# EAGLE design untitled (EAGLE 5.08)
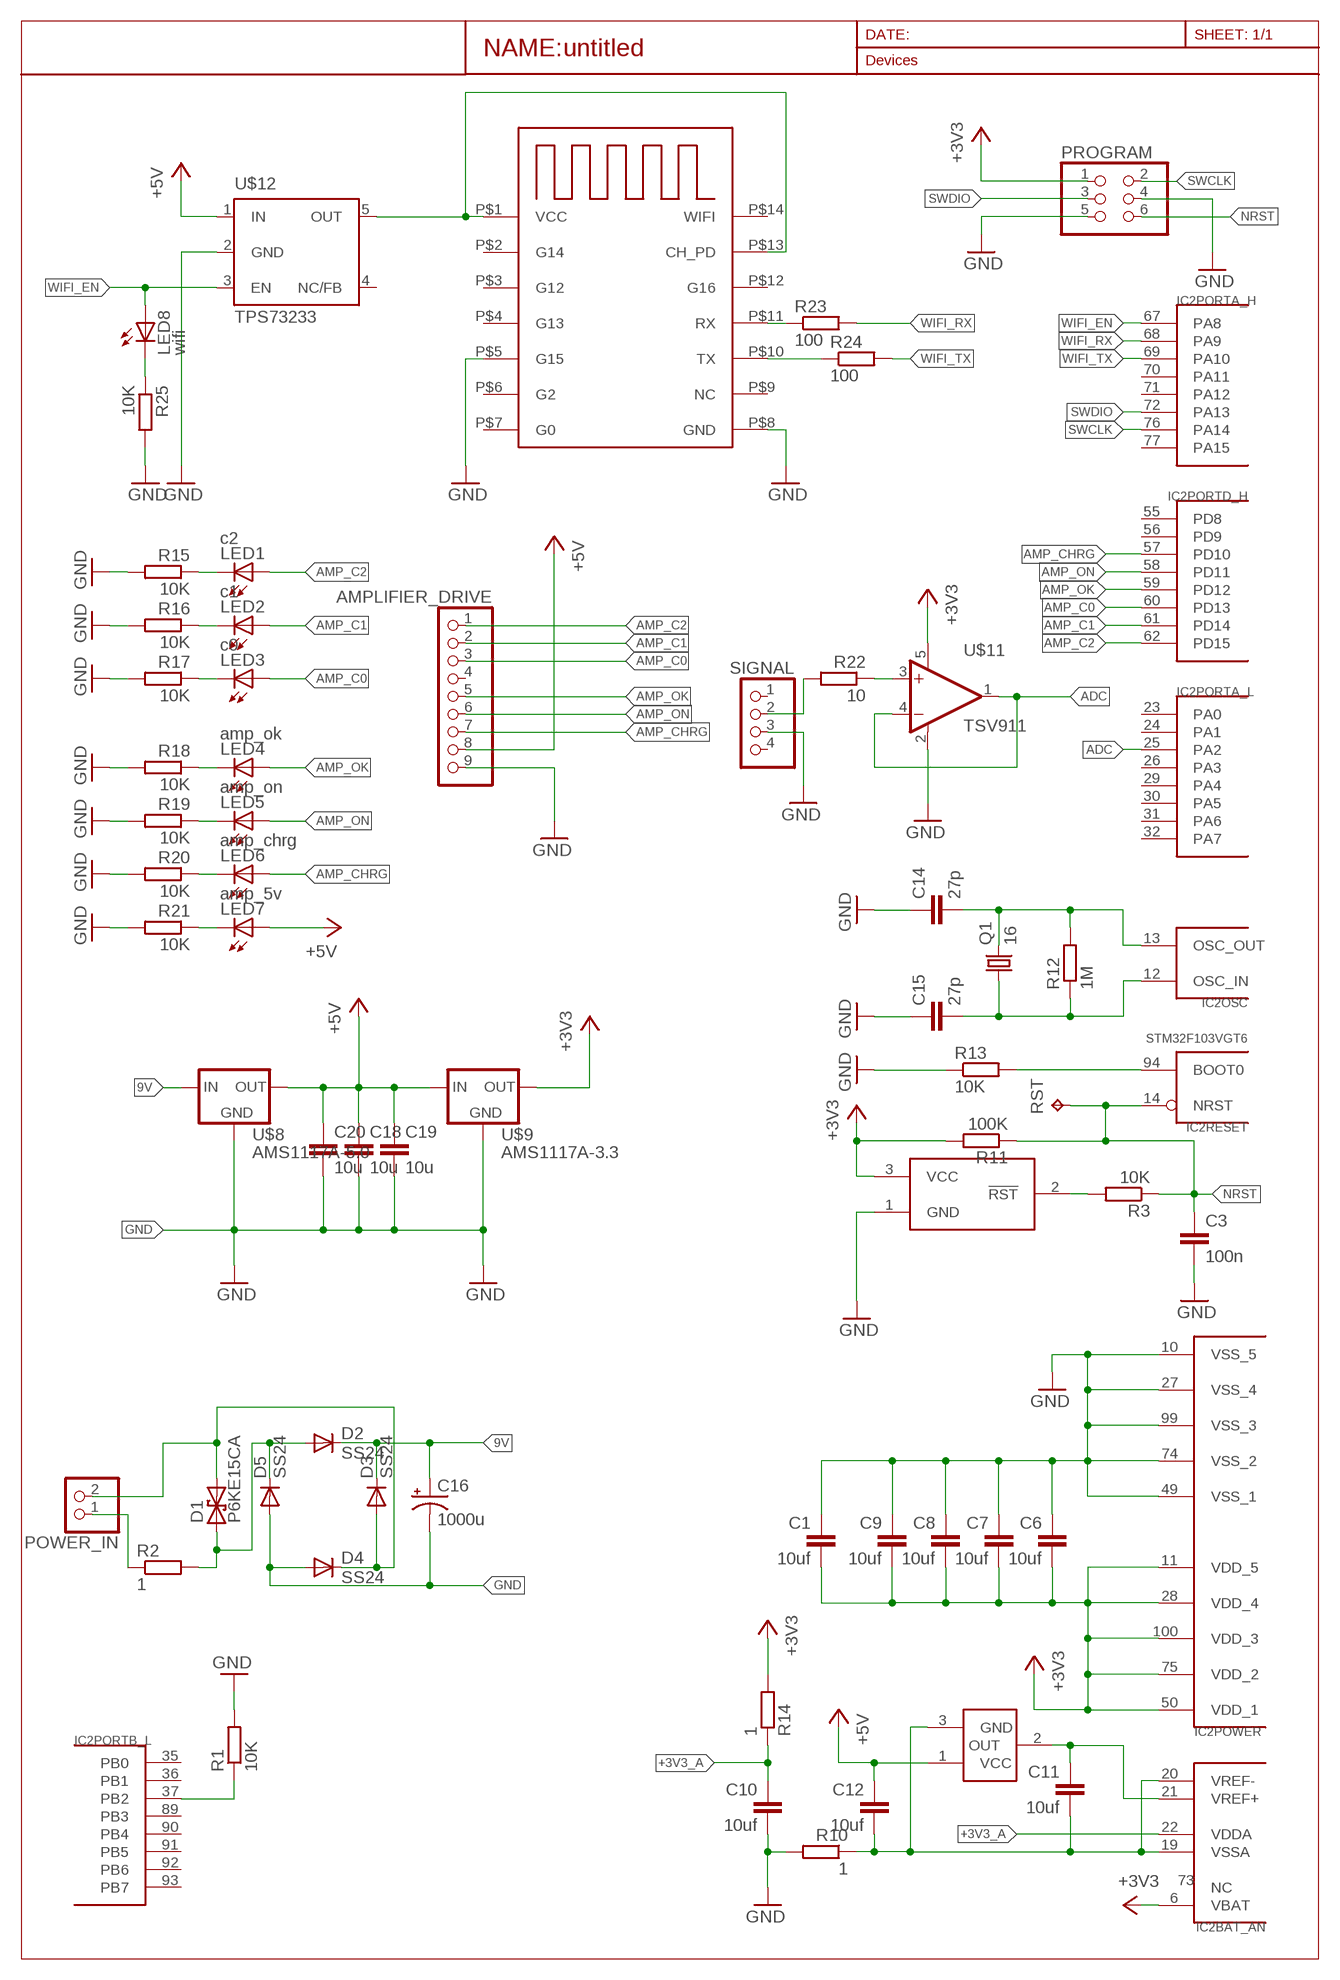
[diagram p0: schematic, sheet 1]

## Parts
AMPLIFIER_DRIVE  PINHD-1X09_2.54-S  [1X09-S]
C1  10uf  C-EUC0603  [C0603]
C3  100n  C-EUC0805  [C0805]
C6  10uf  C-EUC0603  [C0603]
C7  10uf  C-EUC0603  [C0603]
C8  10uf  C-EUC0603  [C0603]
C9  10uf  C-EUC0603  [C0603]
C10  10uf  C-EUC0603  [C0603]
C11  10uf  C-EUC0603  [C0603]
C12  10uf  C-EUC0805  [C0805]
C14  27p  C-EUC0603  [C0603]
C15  27p  C-EUC0603  [C0603]
C16  1000u  CPOL-USE5-8.5  [E5-8,5]
C18  10u  C-EUC0603  [C0603]
C19  10u  C-EUC0805  [C0805]
C20  10u  C-EUC0805  [C0805]
D1  P6KE15CA  P6KEXXC  [CB417-15]
D2  SS24  DIODE-SMB  [SMB]
D3  SS24  DIODE-SMB  [SMB]
D4  SS24  DIODE-SMB  [SMB]
D5  SS24  DIODE-SMB  [SMB]
IC2  STM32F103VGT6  STM32F10XVXT6  [TQFP100]
LED1  c2  LEDCHIPLED_0805  [CHIPLED_0805]
LED2  c1  LEDCHIPLED_0805  [CHIPLED_0805]
LED3  c0  LEDCHIPLED_0805  [CHIPLED_0805]
LED4  amp_ok  LEDCHIPLED_0805  [CHIPLED_0805]
LED5  amp_on  LEDCHIPLED_0805  [CHIPLED_0805]
LED6  amp_chrg  LEDCHIPLED_0805  [CHIPLED_0805]
LED7  amp_5v  LEDCHIPLED_0805  [CHIPLED_0805]
LED8  wifi  LEDCHIPLED_0805  [CHIPLED_0805]
POWER_IN  PINHD-1X2  [1X02]
PROGRAM  PINHD-2X03_2.54-SMD  [2X03SMD]
Q1  16  CRYSTALHC49UP  [HC49UP]
R1  10K  R-EU_R0603  [R0603]
R2  1  R-EU_R1206  [R1206]
R3  10K  R-EU_R0603  [R0603]
R10  1  R-EU_R0603  [R0603]
R11  100K  R-EU_R0603  [R0603]
R12  1M  R-EU_R0603  [R0603]
R13  10K  R-EU_R0603  [R0603]
R14  1  R-EU_R0603  [R0603]
R15  10K  R-EU_R0603  [R0603]
R16  10K  R-EU_R0603  [R0603]
R17  10K  R-EU_R0603  [R0603]
R18  10K  R-EU_R0603  [R0603]
R19  10K  R-EU_R0603  [R0603]
R20  10K  R-EU_R0603  [R0603]
R21  10K  R-EU_R0603  [R0603]
R22  10  R-EU_R0603  [R0603]
R23  100  R-EU_R0603  [R0603]
R24  100  R-EU_R0603  [R0603]
R25  10K  R-EU_R0603  [R0603]
RST  TPTP14SQ  [TP14SQ]
SIGNAL  PINHD-1X04_2.54-S  [1X04-S]
U$6  REF3025  [SOT23]
U$7  ESP03  [ESP03]
U$8  AMS1117A-5.0  AMS1117A  [DPACK]
U$9  AMS1117A-3.3  AMS1117A  [DPACK]
U$10  LM809  [SOT23]
U$11  TSV911  [SOT23-5L]
U$12  TPS73233  [SOT23-DBV]

## Nets
9V: C16.+ D2.C D3.C U$8.3(IN)
+3V3: C1.2 C6.2 C7.2 C8.2 C9.2 IC2.6(BAT_AN:VBAT) IC2.11(POWER:VDD_5) IC2.28(POWER:VDD_4) IC2.50(POWER:VDD_1) IC2.75(POWER:VDD_2) IC2.100(POWER:VDD_3) PROGRAM.1 R11.2 R14.2 U$9.2(OUT) U$10.3(VCC) U$11.5(V+)
+3V3_A: C10.1 IC2.22(BAT_AN:VDDA) R14.1
+5V: AMPLIFIER_DRIVE.8 C12.1 C18.1 C19.1 C20.1 LED7.A U$6.1(VCC) U$8.2(OUT) U$9.3(IN) U$12.1(IN)
ADC: IC2.25(PORTA_L:PA2) U$11.1(OUT) U$11.4(-IN)
AMP_C0: AMPLIFIER_DRIVE.3 IC2.60(PORTD_H:PD13) LED3.A
AMP_C1: AMPLIFIER_DRIVE.2 IC2.61(PORTD_H:PD14) LED2.A
AMP_C2: AMPLIFIER_DRIVE.1 IC2.62(PORTD_H:PD15) LED1.A
AMP_CHRG: AMPLIFIER_DRIVE.7 IC2.57(PORTD_H:PD10) LED6.A
AMP_OK: AMPLIFIER_DRIVE.5 IC2.59(PORTD_H:PD12) LED4.A
AMP_ON: AMPLIFIER_DRIVE.6 IC2.58(PORTD_H:PD11) LED5.A
GND: AMPLIFIER_DRIVE.9 C1.1 C3.2 C6.1 C7.1 C8.1 C9.1 C10.2 C14.1 C15.1 C16.- C18.2 C19.2 C20.2 D4.A D5.A IC2.10(POWER:VSS_5) IC2.27(POWER:VSS_4) IC2.49(POWER:VSS_1) IC2.74(POWER:VSS_2) IC2.99(POWER:VSS_3) PROGRAM.4 PROGRAM.5 R1.2 R10.2 R13.1 R15.2 R16.2 R17.2 R18.2 R19.2 R20.2 R21.2 R25.2 SIGNAL.3 U$7.P$5(G15) U$7.P$8(GND) U$8.1(GND) U$9.1(GND) U$10.1(GND) U$11.2(V-) U$12.2(GND)
GND_A: C11.2 C12.2 IC2.19(BAT_AN:VSSA) IC2.20(BAT_AN:VREF-) R10.1 U$6.3(GND)
N$1: IC2.37(PORTB_L:PB2) R1.1
N$2: POWER_IN.1 R2.1
N$3: R3.2 U$10.2(!RST)
N$12: D1.A D2.A D5.C R2.2
N$14: C11.1 IC2.21(BAT_AN:VREF+) U$6.2(OUT)
N$20: C14.2 IC2.13(OSC:OSC_OUT) Q1.2 R12.2
N$21: C15.2 IC2.12(OSC:OSC_IN) Q1.1 R12.1
N$22: IC2.94(RESET:BOOT0) R13.2
N$23: D1.C D3.A D4.C POWER_IN.2
N$24: U$7.P$1(VCC) U$7.P$13(CH_PD) U$12.5(OUT)
N$25: LED8.C R25.1
N$28: R22.1 U$11.3(+IN)
N$29: LED7.C R21.1
N$32: R22.2 SIGNAL.2
N$35: LED1.C R15.1
N$36: LED2.C R16.1
N$37: LED3.C R17.1
N$38: LED4.C R18.1
N$39: LED5.C R19.1
N$40: LED6.C R20.1
NRST: C3.1 IC2.14(RESET:NRST) PROGRAM.6 R3.1 R11.1 RST.TP
SWCLK: IC2.76(PORTA_H:PA14) PROGRAM.2
SWDIO: IC2.72(PORTA_H:PA13) PROGRAM.3
WIFI_EN: IC2.67(PORTA_H:PA8) LED8.A U$12.3(EN)
WIFI_RX: IC2.68(PORTA_H:PA9) R23.2
WIFI_RX1: R23.1 U$7.P$11(RX)
WIFI_TX: IC2.69(PORTA_H:PA10) R24.2
WIFI_TX1: R24.1 U$7.P$10(TX)
Unconnected: AMPLIFIER_DRIVE.4 IC2.1(PORTE_L:PE2) IC2.2(PORTE_L:PE3) IC2.3(PORTE_L:PE4) IC2.4(PORTE_L:PE5) IC2.5(PORTE_L:PE6) IC2.7(PORTC_H:PC13) IC2.8(PORTC_H:PC14) IC2.9(PORTC_H:PC15) IC2.15(PORTC_L:PC0) IC2.16(PORTC_L:PC1) IC2.17(PORTC_L:PC2) IC2.18(PORTC_L:PC3) IC2.23(PORTA_L:PA0) IC2.24(PORTA_L:PA1) IC2.26(PORTA_L:PA3) IC2.29(PORTA_L:PA4) IC2.30(PORTA_L:PA5) IC2.31(PORTA_L:PA6) IC2.32(PORTA_L:PA7) IC2.33(PORTC_L:PC4) IC2.34(PORTC_L:PC5) IC2.35(PORTB_L:PB0) IC2.36(PORTB_L:PB1) IC2.38(PORTE_L:PE7) IC2.39(PORTE_H:PE8) IC2.40(PORTE_H:PE9) IC2.41(PORTE_H:PE10) IC2.42(PORTE_H:PE11) IC2.43(PORTE_H:PE12) IC2.44(PORTE_H:PE13) IC2.45(PORTE_H:PE14) IC2.46(PORTE_H:PE15) IC2.47(PORTB_H:PB10) IC2.48(PORTB_H:PB11) IC2.51(PORTB_H:PB12) IC2.52(PORTB_H:PB13) IC2.53(PORTB_H:PB14) IC2.54(PORTB_H:PB15) IC2.55(PORTD_H:PD8) IC2.56(PORTD_H:PD9) IC2.63(PORTC_L:PC6) IC2.64(PORTC_L:PC7) IC2.65(PORTC_H:PC8) IC2.66(PORTC_H:PC9) IC2.70(PORTA_H:PA11) IC2.71(PORTA_H:PA12) IC2.73(BAT_AN:NC) IC2.77(PORTA_H:PA15) IC2.78(PORTC_H:PC10) IC2.79(PORTC_H:PC11) IC2.80(PORTC_H:PC12) IC2.81(PORTD_L:PD0) IC2.82(PORTD_L:PD1) IC2.83(PORTD_L:PD2) IC2.84(PORTD_L:PD3) IC2.85(PORTD_L:PD4) IC2.86(PORTD_L:PD5) IC2.87(PORTD_L:PD6) IC2.88(PORTD_L:PD7) IC2.89(PORTB_L:PB3) IC2.90(PORTB_L:PB4) IC2.91(PORTB_L:PB5) IC2.92(PORTB_L:PB6) IC2.93(PORTB_L:PB7) IC2.95(PORTB_H:PB8) IC2.96(PORTB_H:PB9) IC2.97(PORTE_L:PE0) IC2.98(PORTE_L:PE1) SIGNAL.1 SIGNAL.4 U$7.P$2(G14) U$7.P$3(G12) U$7.P$4(G13) U$7.P$6(G2) U$7.P$7(G0) U$7.P$9(NC) U$7.P$12(G16) U$7.P$14(WIFI) U$12.4(NC/FB)

## Library data of the parts
AMPLIFIER_DRIVE = pinhead-2:PINHD-1X09: PIN HEADER
C1 C3 C6-C12 C14 C15 C18-C20 = rcl:C-EU: CAPACITOR, European symbol
C16 = rcl:CPOL-US: POLARIZED CAPACITOR, American symbol
D1 = diode:P6KEXXC: DIODE transient-voltage suppressor
D2-D5 = diode:DIODE-: DIODE
IC2 = stm32:STM32F10XVXT6: STM32F101/103 100 pin LQFP
LED1-LED8 = led:LED: LED OSRAM: - CHIPLED LG R971, LG N971, LY N971, LG Q971, LY Q971, LO R971, LY R971 LH N974, LH R974 LS Q976, LO Q976, LY Q976 LO Q996 - Hyper CHIPLED LW Q18S LB Q993, LB Q99A, LB R99A - SideLED LS A670, LO A670, LY A670, LG A670, LP A670 LB A673, LV A673, LT A673, LW A673 LH A674 LY A675 LS A676, LA A676, LO A676, LY A676, LW A676 LS A679, LY A679, LG A679 - Hyper Micro SIDELED® LS Y876, LA Y876, LO Y876, LY Y876 LT Y87S - SmartLED LW L88C, LW L88S LB L89C, LB L89S, LG L890 LS L89K, LO L89K, LY L89K LS L896, LA L896, LO L896, LY L896 - TOPLED LS T670, LO T670, LY T670, LG T670, LP T670 LSG T670, LSP T670, LSY T670, LOP T670, LYG T670 LG T671, LOG T671, LSG T671 LB T673, LV T673, LT T673, LW T673 LH T674 LS T676, LA T676, LO T676, LY T676, LB T676, LH T676, LSB T676, LW T676 LB T67C, LV T67C, LT T67C, LS T67K, LO T67K, LY T67K, LW E67C LS E67B, LA E67B, LO E67B, LY E67B, LB E67C, LV E67C, LT E67C LW T67C LS T679, LY T679, LG T679 LS T770, LO T770, LY T770, LG T770, LP T770 LB T773, LV T773, LT T773, LW T773 LH T774 LS E675, LA E675, LY E675, LS T675 LS T776, LA T776, LO T776, LY T776, LB T776 LHGB T686 LT T68C, LB T68C - Hyper Mini TOPLED® LB M676 - Mini TOPLED Santana® LG M470 LS M47K, LO M47K, LY M47K Source: http://www.osram.convergy.de LUXEON: - LUMILED® LXK2-PW12-R00, LXK2-PW12-S00, LXK2-PW14-U00, LXK2-PW14-V00 LXK2-PM12-R00, LXK2-PM12-S00, LXK2-PM14-U00 LXK2-PE12-Q00, LXK2-PE12-R00, LXK2-PE12-S00, LXK2-PE14-T00, LXK2-PE14-U00 LXK2-PB12-K00, LXK2-PB12-L00, LXK2-PB12-M00, LXK2-PB14-N00, LXK2-PB14-P00, LXK2-PB14-Q00 LXK2-PR12-L00, LXK2-PR12-M00, LXK2-PR14-Q00, LXK2-PR14-R00 LXK2-PD12-Q00, LXK2-PD12-R00, LXK2-PD12-S00 LXK2-PH12-R00, LXK2-PH12-S00 LXK2-PL12-P00, LXK2-PL12-Q00, LXK2-PL12-R00 Source: www.luxeon.com KINGBRIGHT: KA-3528ASYC Source: www.kingbright.com
POWER_IN = pinhead:PINHD-1X2: PIN HEADER
PROGRAM = pinhead-2:PINHD-2X03: PIN HEADER
Q1 = crystal:CRYSTAL: CRYSTAL
R1-R3 R10-R25 = resistor:R-EU_: RESISTOR, European symbol
RST = testpad:TP: Test pad
SIGNAL = pinhead-2:PINHD-1X04: PIN HEADER
U$6 = ADC:REF3025
U$7 = connectors:ESP03
U$8 U$9 = stabil:AMS1117A
U$10 = ARM:LM809
U$11 = OU:TSV911
U$12 = stabil:TPS73233

## Board
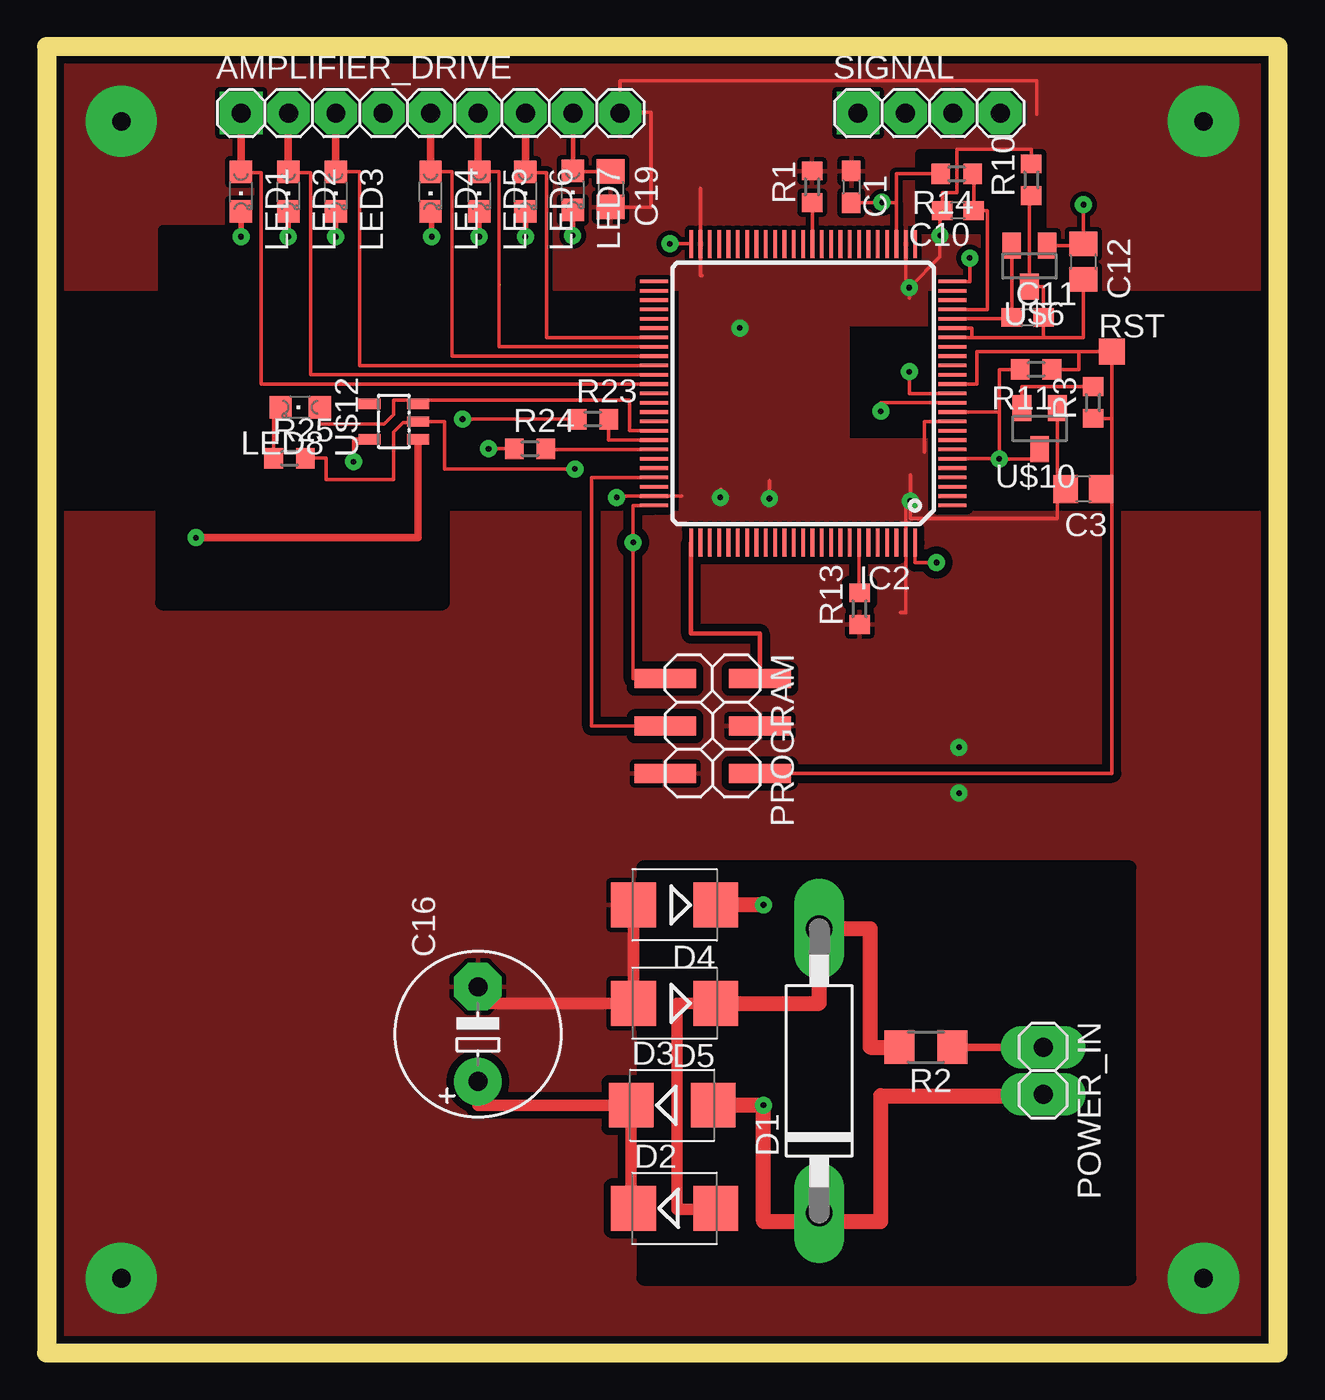
[diagram p1: board, top side]
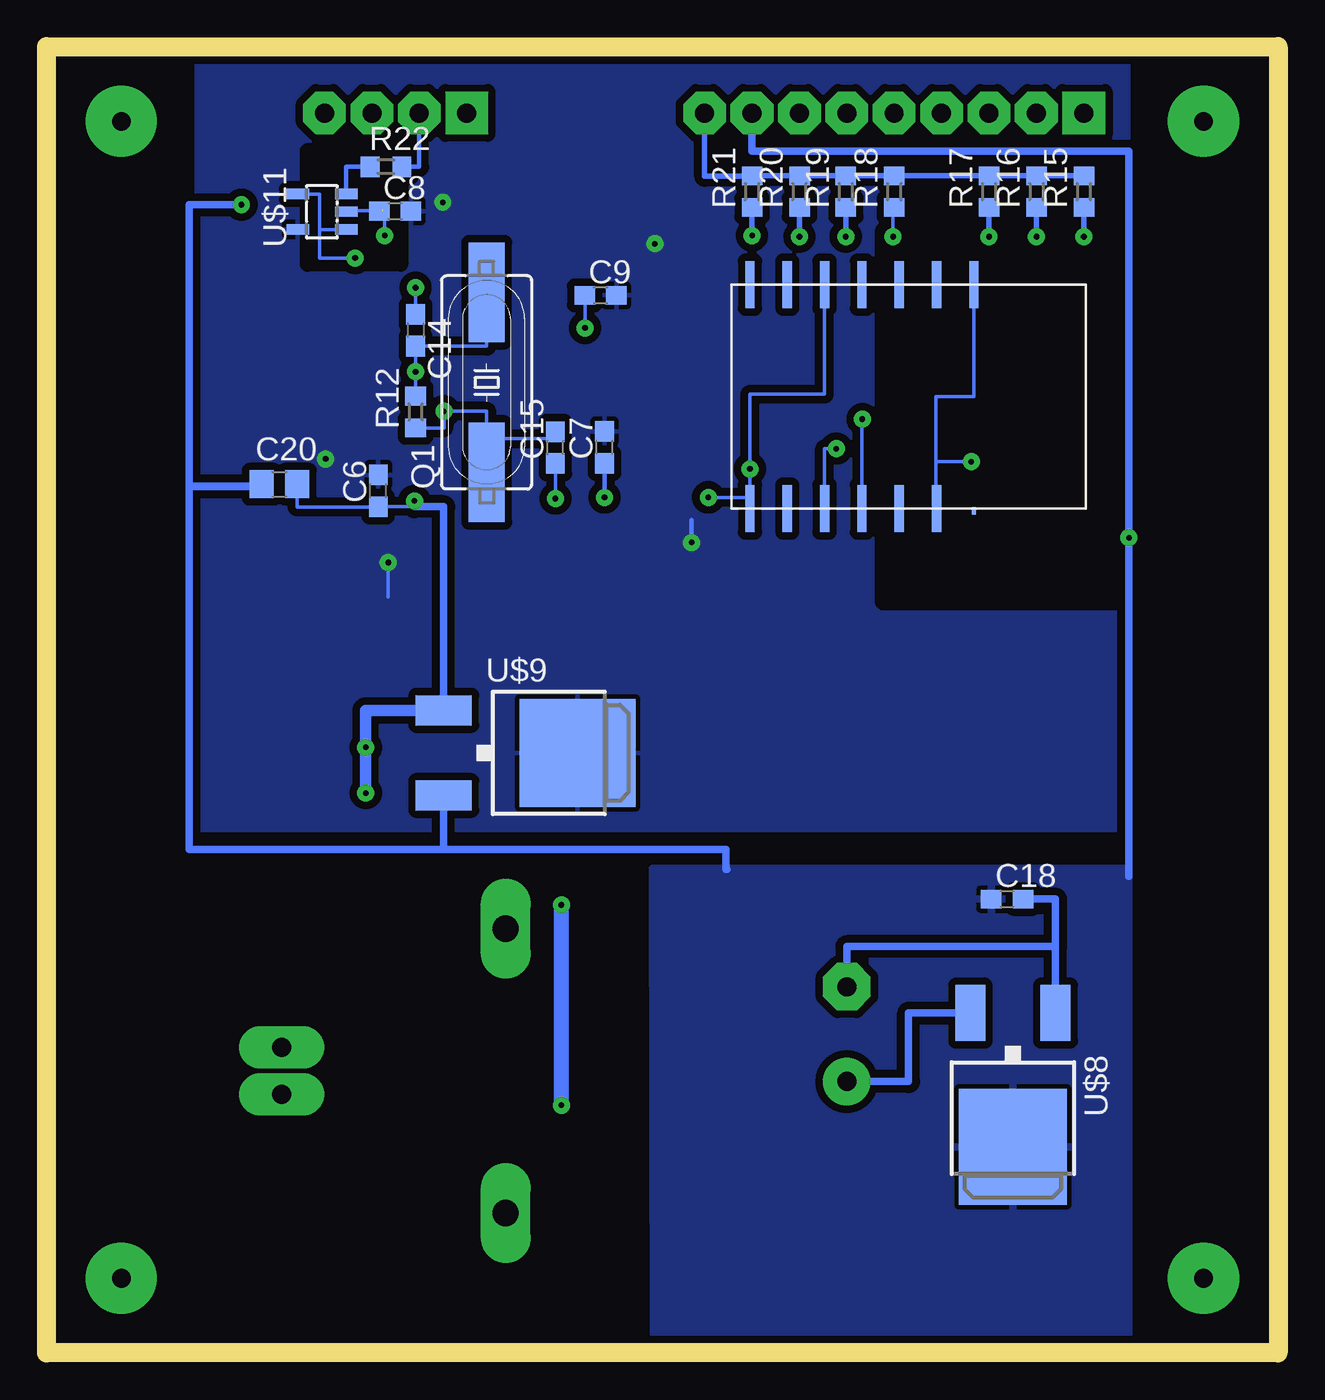
[diagram p2: board, bottom side, seen from below]

Size 66 x 70 mm. Coordinates in mm from the lower left corner, seen from the top.
Outline: 0,0 66,0 66,70 0,70 0,0
Copper layers (1*16): Top 0.015mm / dielectric 1.5mm / Bottom 0.015mm
Design rules "default *": minimum track width 0.2mm, minimum drill 0.3mm, track to track 0.25mm, track to pad 0.25mm, pad to pad 0.25mm, via to via 0.25mm, smd to smd 0.25mm, copper to edge 0.4mm, drill to drill 0.4mm, minimum pad ring 25mil, minimum via ring 12mil, stop-mask expansion 4mil, vias tented up to drill 0mil, thermal gap 10mil
tRestrict: area 6.2,40.2 to 21.2,60.2; area 32,4 to 58,26; area 43.1,49 to 47.3,55; area 46.8,60.2 to 53.3,64.3
bRestrict: area 6.2,40.2 to 21.2,60.2; area 47,58.3 to 52,64.4

### Footprints (pad centres in the part's own frame; a part is rotated, then mirrored left to right if it is on the bottom)
1X09-S = drill 1.016 square: 1 -10.16,0 | drill 1.016 octagon: 2 -7.62,0; 3 -5.08,0; 4 -2.54,0; 5 0,0; 6 2.54,0; 7 5.08,0; 8 7.62,0; 9 10.16,0
C0603 = smd 1.1 x 1: 1 -0.85,0; 2 0.85,0
C0805 = smd 1.3 x 1.5: 1 -0.95,0; 2 0.95,0
E5-8,5 = drill 1.016 pad 2.54 round: + -2.54,0 | drill 1.016 pad 2.54 octagon: - 2.54,0
CB417-15 = drill 1.397 long: A 7.62,0; C -7.62,0
SMB = smd 2.4 x 2.4: A 2.2,0; C -2.2,0
TQFP100 = smd 1.5 x 0.2: 1 -8,6; 2 -8,5.5; 3 -8,5; 4 -8,4.5; 5 -8,4; 6 -8,3.5; 7 -8,3; 8 -8,2.5; 9 -8,2; 10 -8,1.5; 11 -8,1; 12 -8,0.5; 13 -8,0; 14 -8,-0.5; 15 -8,-1; 16 -8,-1.5; 17 -8,-2; 18 -8,-2.5; 19 -8,-3; 20 -8,-3.5; 21 -8,-4; 22 -8,-4.5; 23 -8,-5; 24 -8,-5.5; 25 -8,-6; 51 8,-6; 52 8,-5.5; 53 8,-5; 54 8,-4.5; 55 8,-4; 56 8,-3.5; 57 8,-3; 58 8,-2.5; 59 8,-2; 60 8,-1.5; 61 8,-1; 62 8,-0.5; 63 8,0; 64 8,0.5; 65 8,1; 66 8,1.5; 67 8,2; 68 8,2.5; 69 8,3; 70 8,3.5; 71 8,4; 72 8,4.5; 73 8,5; 74 8,5.5; 75 8,6 | smd 0.2 x 1.5: 26 -6,-8; 27 -5.5,-8; 28 -5,-8; 29 -4.5,-8; 30 -4,-8; 31 -3.5,-8; 32 -3,-8; 33 -2.5,-8; 34 -2,-8; 35 -1.5,-8; 36 -1,-8; 37 -0.5,-8; 38 0,-8; 39 0.5,-8; 40 1,-8; 41 1.5,-8; 42 2,-8; 43 2.5,-8; 44 3,-8; 45 3.5,-8; 46 4,-8; 47 4.5,-8; 48 5,-8; 49 5.5,-8; 50 6,-8; 76 6,8; 77 5.5,8; 78 5,8; 79 4.5,8; 80 4,8; 81 3.5,8; 82 3,8; 83 2.5,8; 84 2,8; 85 1.5,8; 86 1,8; 87 0.5,8; 88 0,8; 89 -0.5,8; 90 -1,8; 91 -1.5,8; 92 -2,8; 93 -2.5,8; 94 -3,8; 95 -3.5,8; 96 -4,8; 97 -4.5,8; 98 -5,8; 99 -5.5,8; 100 -6,8
CHIPLED_0805 = smd 1.2 x 1.2: A 0,-1.05; C 0,1.05
1X02 = drill 1.016 long: 1 -1.27,0; 2 1.27,0
2X03SMD = smd 1.016 x 3.302: 1 -1.27,-3.81; 2 -1.27,1.27; 3 1.27,-3.81; 4 1.27,1.27; 5 3.81,-3.81; 6 3.81,1.27
HC49UP = smd 5.334 x 1.93: 1 -4.826,0; 2 4.826,0
R0603 = smd 1 x 1.1: 1 -0.85,0; 2 0.85,0
R1206 = smd 1.6 x 1.803: 1 -1.422,0; 2 1.422,0
TP14SQ = smd 1.4 x 1.4: TP 0,0
1X04-S = drill 1.016 square: 1 -3.81,0 | drill 1.016 octagon: 2 -1.27,0; 3 1.27,0; 4 3.81,0
SOT23 = smd 1 x 1.4: 1 -0.95,-1.1; 2 0.95,-1.1; 3 0,1.1
ESP03 = smd 2.54 x 0.5: P$1 0,0; P$2 0,-2; P$3 0,-4; P$4 0,-6; P$5 0,-8; P$6 0,-10; P$7 0,-12; P$8 12,-12; P$9 12,-10; P$10 12,-8; P$11 12,-6; P$12 12,-4; P$13 12,-2 | smd 0.406 x 0.203: P$14 12.13,0
DPACK = smd 1.6 x 3: 1 -2.28,-4.8; 3 2.28,-4.8 | smd 5.8 x 6.2: 2 0,2.38
SOT23-5L = smd 0.55 x 1.2: 1 -0.95,-1.3; 2 0,-1.3; 3 0.95,-1.3; 4 0.95,1.3; 5 -0.95,1.3
SOT23-DBV = smd 0.55 x 1.2: 1 -0.95,-1.3; 2 0,-1.3; 3 0.95,-1.3; 4 0.95,1.3; 5 -0.95,1.3

### Placement (x,y rotation side)
AMPLIFIER_DRIVE  20.58,66.44 0 top
C1  43.12,62.48 270 top
C3  55.56,46.29 180 top
C6  48.23,46.2 90 bottom
C7  36.1,48.53 90 bottom
C8  47.33,61.18 0 bottom
C9  36.32,56.67 0 bottom
C10  48.83,61.21 180 top
C11  52.58,55.5 0 top
C12  55.54,58.47 270 top
C14  46.23,54.8 270 bottom
C15  38.73,48.51 90 bottom
C16  23.11,17.08 90 top
C18  14.52,24.32 0 bottom
C19  30.23,62.36 270 top
C20  53.53,46.55 0 bottom
D1  41.4,15.11 90 top
D2  33.66,7.75 0 top
D3  33.53,13.27 0 top
D4  33.66,24 180 top
D5  33.66,18.73 180 top
IC2  40.54,51.42 180 top
LED1  10.41,62.23 180 top
LED2  12.95,62.23 180 top
LED3  15.49,62.23 180 top
LED4  20.57,62.23 180 top
LED5  23.18,62.23 180 top
LED6  25.65,62.23 180 top
LED7  28.19,62.29 180 top
LED8  13.59,50.67 90 top
POWER_IN  53.4,15.11 270 top
PROGRAM  36.96,34.86 270 top
Q1  42.42,52.01 90 bottom
R1  41.02,62.48 90 top
R2  47.12,16.38 180 top
R3  56.07,50.93 90 top
R10  52.77,62.87 90 top
R11  53.02,52.7 180 top
R12  46.23,50.42 90 bottom
R13  43.56,39.88 90 top
R14  48.77,63.18 180 top
R15  10.41,62.23 90 bottom
R16  12.95,62.23 90 bottom
R17  15.49,62.23 90 bottom
R18  20.57,62.23 90 bottom
R19  23.18,62.23 90 bottom
R20  25.65,62.23 90 bottom
R21  28.19,62.23 90 bottom
R22  47.82,63.56 0 bottom
R23  29.27,50.04 0 top
R24  25.91,48.45 0 top
R25  13.02,47.94 0 top
RST  57.09,53.66 0 top
SIGNAL  47.3,66.44 0 top
U$6  52.67,58.24 180 top
U$7  16.31,57.25 270 bottom
U$8  14.22,13.42 180 bottom
U$9  39.92,32.15 270 bottom
U$10  53.21,49.53 180 top
U$11  51.24,61.15 90 bottom
U$12  18.61,49.91 90 top

### Tracks (layer width: path | path; a pad name or v marks a point on that pad's centre or on a via)
9V
  Top 0.61: C16.+ 23.11,13.27 D3.C 31.33,7.75 D2.C
  Bottom 0.406: U$8.3 19.81,18.22 19.81,14.54 C16.+
+3V3  (via drill 0.3, 0.3 pad 0.25)
  Top 0.2: IC2.50 34.54,59.44 v33.4,59.44 | v47.69,42.35 46.54,42.35 IC2.100 | IC2.75 31.43,45.42 v31.43,43.43 31.43,36.13 PROGRAM.1 | 51.05,50.42 IC2.11 | v51.05,47.9 51.05,50.42 | v51.05,47.9 53.21,47.9 U$10.3 | R14.2 45.54,63.18 45.54,61.63 | 51.05,50.42 51.05,52.7 R11.2 | 45.54,61.63 IC2.28 | C1.2 44.7,61.63 | 44.7,61.63 45.54,61.63 | v44.77,61.66 44.7,61.66 44.7,61.63 | IC2.6 51.05,47.92 v51.05,47.9
  Bottom 0.2: v33.4,59.44 33.21,59.44 | 47.69,40.51 v47.69,42.35
  Bottom 0.254: v31.43,43.43 31.43,44.64
  pour Bottom (isolate 0.406): 8,70 58,70 58,28 8,28
+3V3_A
  Top 0.2: R14.1 49.68,63.18 C10.1 50.42,61.21 50.42,55.92 IC2.22
+5V  (via drill 0.3)
  Top 0.2: C19.1 28.19,63.31 LED7.A | U$6.1 55.55,59.34 C12.1 55.55,61.53 v55.56,61.53
  Top 0.254: LED7.A AMPLIFIER_DRIVE.8
  Top 0.406: AMPLIFIER_DRIVE.8 | U$12.1 19.91,43.69 v8,43.69
  Bottom 0.2: 54.48,46.42 C20.1 58.36,46.55
  Bottom 0.406: 54.48,46.42 58.36,46.42 58.36,26.99 44.73,26.99 | AMPLIFIER_DRIVE.8 28.2,64.39 8,64.39 v8,43.69 8,25.53 | 44.73,26.99 29.59,26.99 29.59,25.91 29.53,25.91 | 44.73,26.99 U$9.3 | 58.36,46.55 58.36,61.53 v55.56,61.53
  pour Bottom (isolate 0.406): 8,25.97 33.53,25.97 33.46,0.64 8,0.64
ADC  (via drill 0.3)
  Top 0.2: IC2.25 49.47,57.42 v49.47,58.67
  Bottom 0.2: 51.37,60.2 51.37,62.1 U$11.4 | 51.37,60.2 U$11.1 | v49.47,58.67 51.37,58.67 51.37,60.2
AMP_C0
  Top 0.2: IC2.60 16.76,52.92 16.76,63.31 15.49,63.31 LED3.A
  Top 0.406: LED3.A AMPLIFIER_DRIVE.3
AMP_C1
  Top 0.2: IC2.61 14.16,52.42 14.16,63.25 12.95,63.25 LED2.A
  Top 0.406: AMPLIFIER_DRIVE.2 LED2.A
AMP_C2
  Top 0.2: IC2.62 11.49,51.92 11.49,63.25 10.41,63.25 LED1.A
  Top 0.406: LED1.A AMPLIFIER_DRIVE.1
AMP_CHRG
  Top 0.2: IC2.57 26.8,54.42 26.8,63.25 25.65,63.25 LED6.A
  Top 0.406: LED6.A AMPLIFIER_DRIVE.7
AMP_OK
  Top 0.2: IC2.59 21.72,53.42 21.72,63.31 20.57,63.31 LED4.A
  Top 0.406: LED4.A AMPLIFIER_DRIVE.5
AMP_ON
  Top 0.2: IC2.58 24.26,53.92 24.26,63.31 23.18,63.31 LED5.A
  Top 0.406: LED5.A 23.12,63.28 AMPLIFIER_DRIVE.6
GND  (via drill 0.3, 1 pad 3.81)  (2 unrouted)
  Top 0.2: v38.73,45.78 38.73,46.74 | v46.23,57.09 46.23,56.52 | 53.08,66.38 53.08,68.18 30.74,68.18 AMPLIFIER_DRIVE.9 30.74,66.48 32.38,66.48 32.38,61.41 C19.2 | v28.31,47.37 21.34,47.37 21.34,49.91 U$12.2 19.84,49.85 19.11,49.85 18.61,49.34 18.61,46.8 14.99,46.8 14.99,47.94 R25.2 | v46.23,57.09 47.88,58.74 v47.88,59.88 47.88,61.21 C10.2 | v46.29,45.66 46.29,47.05 | IC2.99 | IC2.74 | 35.12,57.72 35.04,57.72 IC2.49 35.04,62.41 35.05,62.42 | 46.04,57.78 IC2.27 | 46.04,57.78 | IC2.74 34.04,45.92 34.04,45.91 | IC2.74 30.54,45.92 v30.54,45.85 | v37.15,54.93 37.15,54.8 | v36.1,45.85 36.13,45.85 36.13,46.29 | IC2.99 46.04,39.69 45.74,39.69 | IC2.99 46.04,45.66 v46.29,45.66 | 54.17,46.29 54.17,44.7 46.29,44.7 v46.29,45.66 | v46.23,57.09 46.04,57.09 46.04,57.78 | R10.2 52.77,64.52 48.77,64.52 48.77,62.17 48.01,62.17 48.01,61.21 | 54.17,46.29 C3.2 | U$10.1 54.17,46.29 | IC2.10 47.05,49.92 47.05,48.26
  Top 0.254: PROGRAM.4 38.42,33.59
  Top 0.61: C16.- 23.11,18.73 D5.A D4.A
  Bottom 0.2: C14.1 v46.23,57.09 | U$7.P$5 24.32,51.37 28.31,51.37 v28.31,47.37 U$7.P$8 28.31,45.85 v30.54,45.85 | U$11.2 49.94,61.21 48.18,61.21 C8.1 48.18,60.9 47.88,60.9 v47.88,59.88 | C9.1 37.15,56.67 v37.15,54.93 | 46.29,45.35 C6.1 48.23,45.34 52.58,45.34 C20.2 | C15.1 v38.73,45.78
  Bottom 0.254: C7.1 v36.1,45.85
  Bottom 0.305: AMPLIFIER_DRIVE.9 30.73,63.06 28.19,63.06 R21.2 R20.2 R19.2 R18.2 R17.2 R16.2 | R15.2 R16.2 | R16.2 10.29,63.08 10.29,63.18
  Bottom 0.406: v46.29,45.66 46.29,45.35 44.73,45.35 U$9.1 | U$8.1 11.94,24.32 C18.2 11.94,24.32 11.94,21.78 23.11,21.78 C16.-
  Bottom 0.61: v48.9,30 v48.9,32.45 48.9,34.43 U$9.1
  other vias: 4,66 62,66 4,4 62,4
  pour Top: 47.09,44.91 34.02,44.91 34.02,57.98 47.09,57.98
  pour Top (isolate 0.254): 0,70 0,57 66,57 66,70
  pour Top (isolate 0.406): 65,45 65,0 0,0 0,45
GND_A
  Top 0.2: IC2.20 49.59,54.92 49.59,54.42 | IC2.19 49.59,54.42 | 53.43,54.42 C11.2 53.43,57.14 U$6.3 52.67,62.02 R10.1 | 49.59,54.42 53.43,54.42 | 53.43,54.42 55.55,54.42 C12.2
N$1
  Top 0.2: IC2.37 41.04,61.63 R1.1
N$2
  Top 0.406: R2.1 POWER_IN.1
N$3
  Top 0.2: R3.2 52.26,51.78 U$10.2
N$12
  Top 0.61: D2.A 35.85,7.68 33.78,7.68 33.78,18.73 D5.C
  Top 0.813: R2.2 44.13,16.38 44.13,22.73 D1.A 41.4,18.73 D5.C
N$14
  Top 0.2: IC2.21 51.73,55.42 C11.1 | C11.1 | U$6.2 C11.1
N$20  (via drill 0.3)
  Top 0.2: IC2.13 46.23,51.42 v46.23,52.58
  Bottom 0.2: R12.2 v46.23,52.58 C14.2 42.42,53.95 Q1.2
N$21  (via drill 0.3)
  Top 0.2: IC2.12 44.7,50.92 v44.7,50.46
  Bottom 0.2: 42.42,49 42.42,50.46 v44.7,50.46 44.7,49.57 R12.1 | Q1.1 42.42,49 | 42.42,49 38.73,49 C15.2
N$22
  Top 0.2: IC2.94 43.54,40.73 R13.2
N$23  (via drill 0.3)
  Top 0.813: POWER_IN.2 53.4,13.78 44.7,13.78 44.7,7.05 41.4,7.05 | D3.A v38.42,13.27 38.42,7.05 41.4,7.05 | v38.42,24 D4.C | 41.4,7.05 D1.C
  Bottom 0.813: v38.42,13.27 v38.42,24
N$24  (via drill 0.3)
  Top 0.2: U$12.5 16.45,48.96 v16.45,47.75
  Bottom 0.2: U$7.P$1 16.32,51.24 18.35,51.24 18.35,47.75 | 18.35,47.75 18.35,45.25 U$7.P$13 | 18.35,47.75 v16.45,47.75
N$25
  Top 0.2: R25.1 12.17,50.67 LED8.C
N$28
  Bottom 0.254: U$11.3 49.94,63.56 R22.1
N$29  (via drill 0.3)
  Top 0.305: v28.19,59.88 LED7.C
  Bottom 0.305: v28.19,59.88 R21.1
N$32
  Bottom 0.254: R22.2 46.03,63.56 SIGNAL.2
N$35  (via drill 0.3)
  Top 0.305: LED1.C R15.1 v10.41,59.82
  Top 0.406: LED1.C 10.35,61.18
  Bottom 0.305: v10.41,59.82 R15.1
N$36  (via drill 0.3)
  Top 0.305: v12.95,59.82 LED2.C
  Bottom 0.305: v12.95,59.82 R16.1
N$37  (via drill 0.3)
  Top 0.305: v15.49,59.82 LED3.C
  Bottom 0.305: v15.49,59.82 R17.1
N$38  (via drill 0.3)
  Top 0.305: LED4.C 20.64,61.18 v20.64,59.82
  Bottom 0.2: R18.1 20.64,61.38 v20.64,59.82
N$39  (via drill 0.3)
  Top 0.305: v23.18,59.82 LED5.C
  Bottom 0.305: v23.18,59.82 R19.1
N$40  (via drill 0.3)
  Top 0.305: v25.65,59.82 LED6.C
  Bottom 0.305: v25.65,59.82 R20.1
NRST
  Top 0.2: IC2.14 49.85,51.92 49.85,53.66 55.31,53.66 | 55.31,53.66 RST.TP 57.09,50.08 | PROGRAM.6 57.09,31.05 57.09,46.29 | 57.09,46.29 57.09,50.08 | 57.09,50.08 R3.1 | R11.1 55.31,52.7 55.31,53.66 | 57.09,46.29 C3.1
SWCLK
  Top 0.254: IC2.76 34.54,38.54 38.23,38.54 PROGRAM.2
SWDIO
  Top 0.2: IC2.72 29.21,46.92 29.21,33.59 PROGRAM.3
WIFI_EN
  Top 0.2: IC2.67 31.24,49.42 31.24,51.05 19.91,51.05 | 19.91,51.05 U$12.3 | 19.91,51.05 18.61,51.05 18.61,50.29 18.1,49.78 14.64,49.78 LED8.A
WIFI_RX
  Top 0.2: IC2.68 30.12,48.92 R23.2
WIFI_RX1  (via drill 0.3)
  Top 0.2: v22.29,50.04 R23.1
  Bottom 0.2: U$7.P$11 22.31,50.04 v22.29,50.04
WIFI_TX
  Top 0.2: IC2.69 26.76,48.42 R24.2
WIFI_TX1  (via drill 0.3)
  Top 0.2: v23.69,48.45 R24.1
  Bottom 0.2: v23.69,48.45 24.31,48.45 U$7.P$10